# EAGLE schematic led-test (EAGLE 8.3.2)
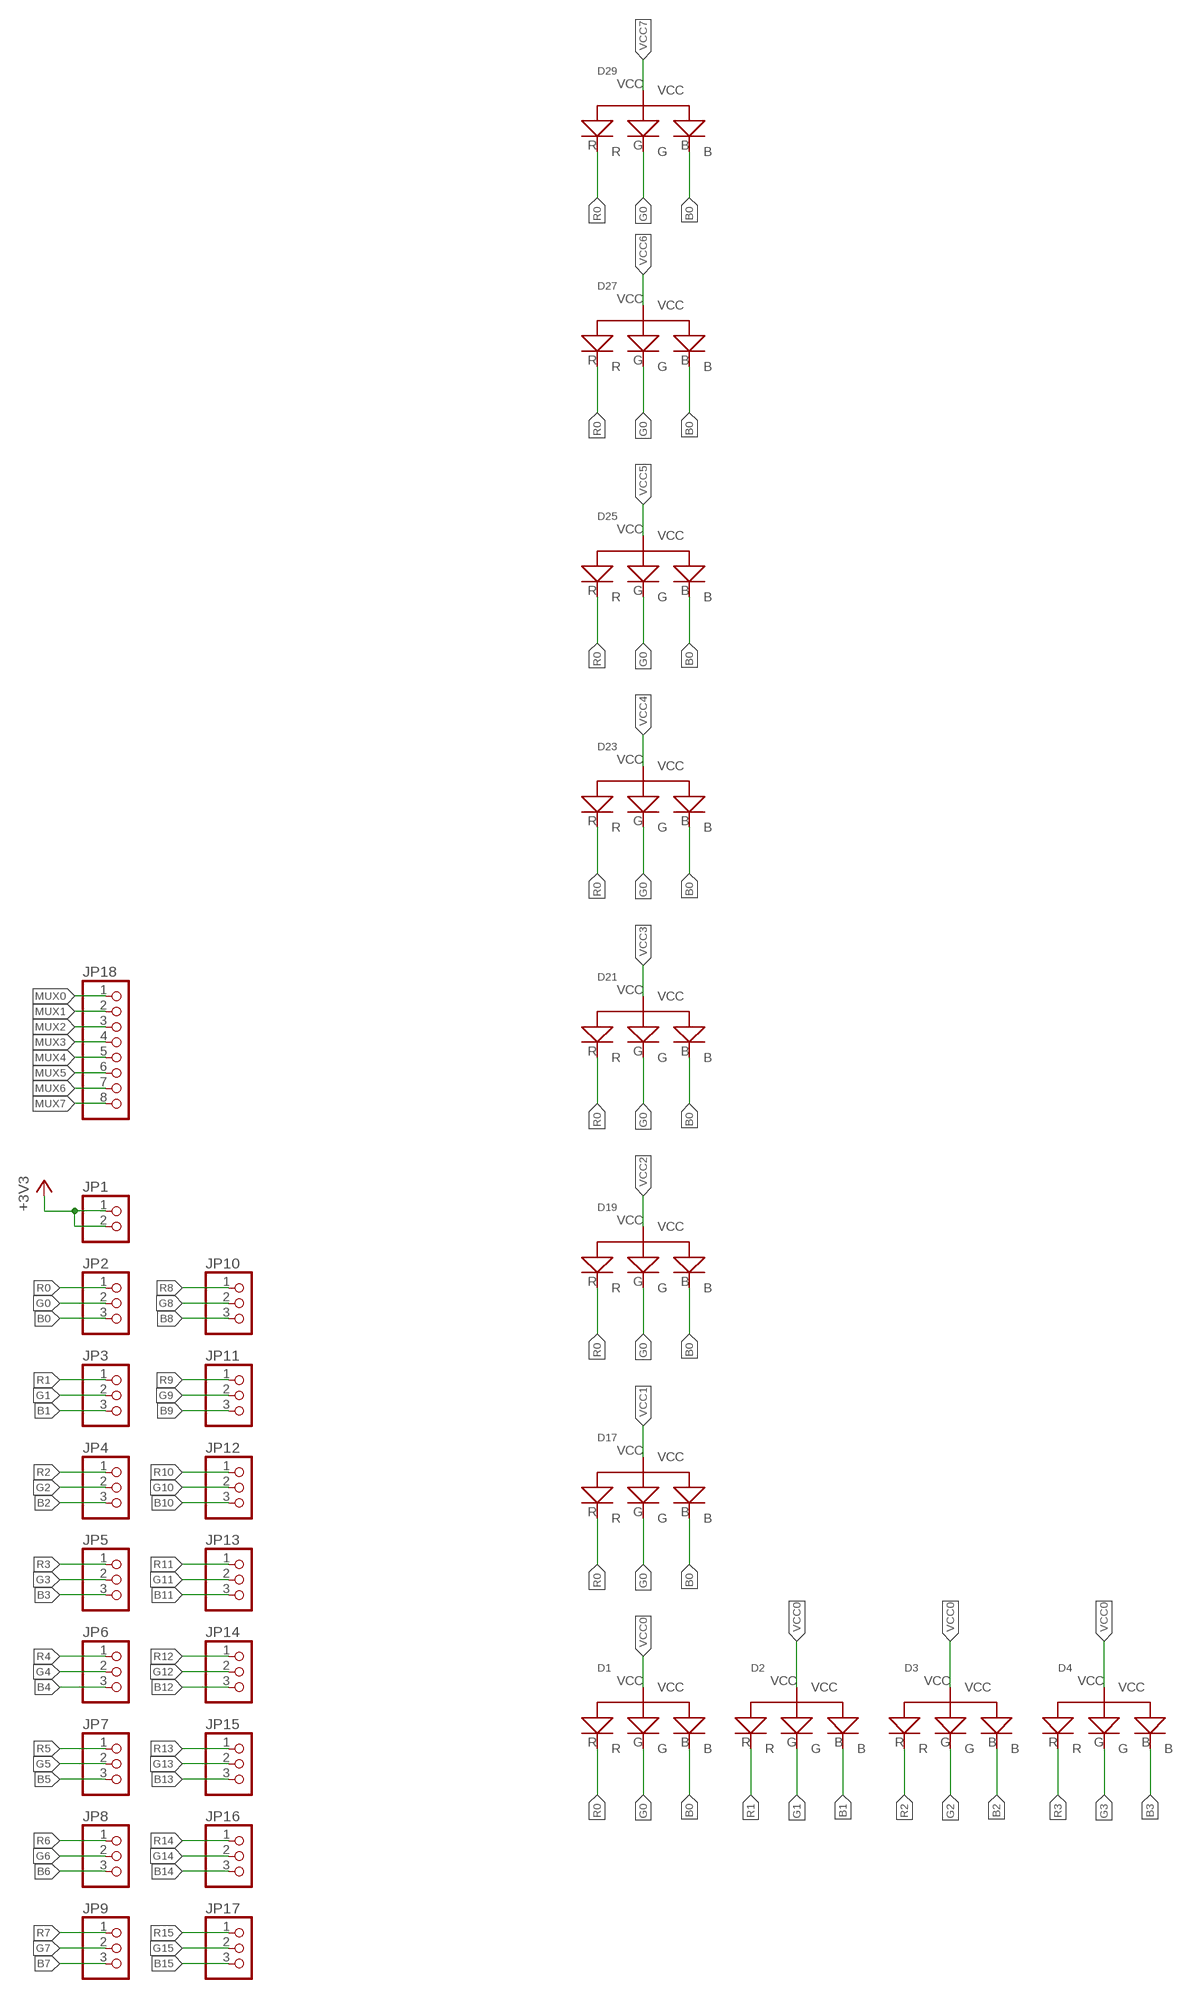
[diagram p0: schematic, sheet 1, part 1 of 2]
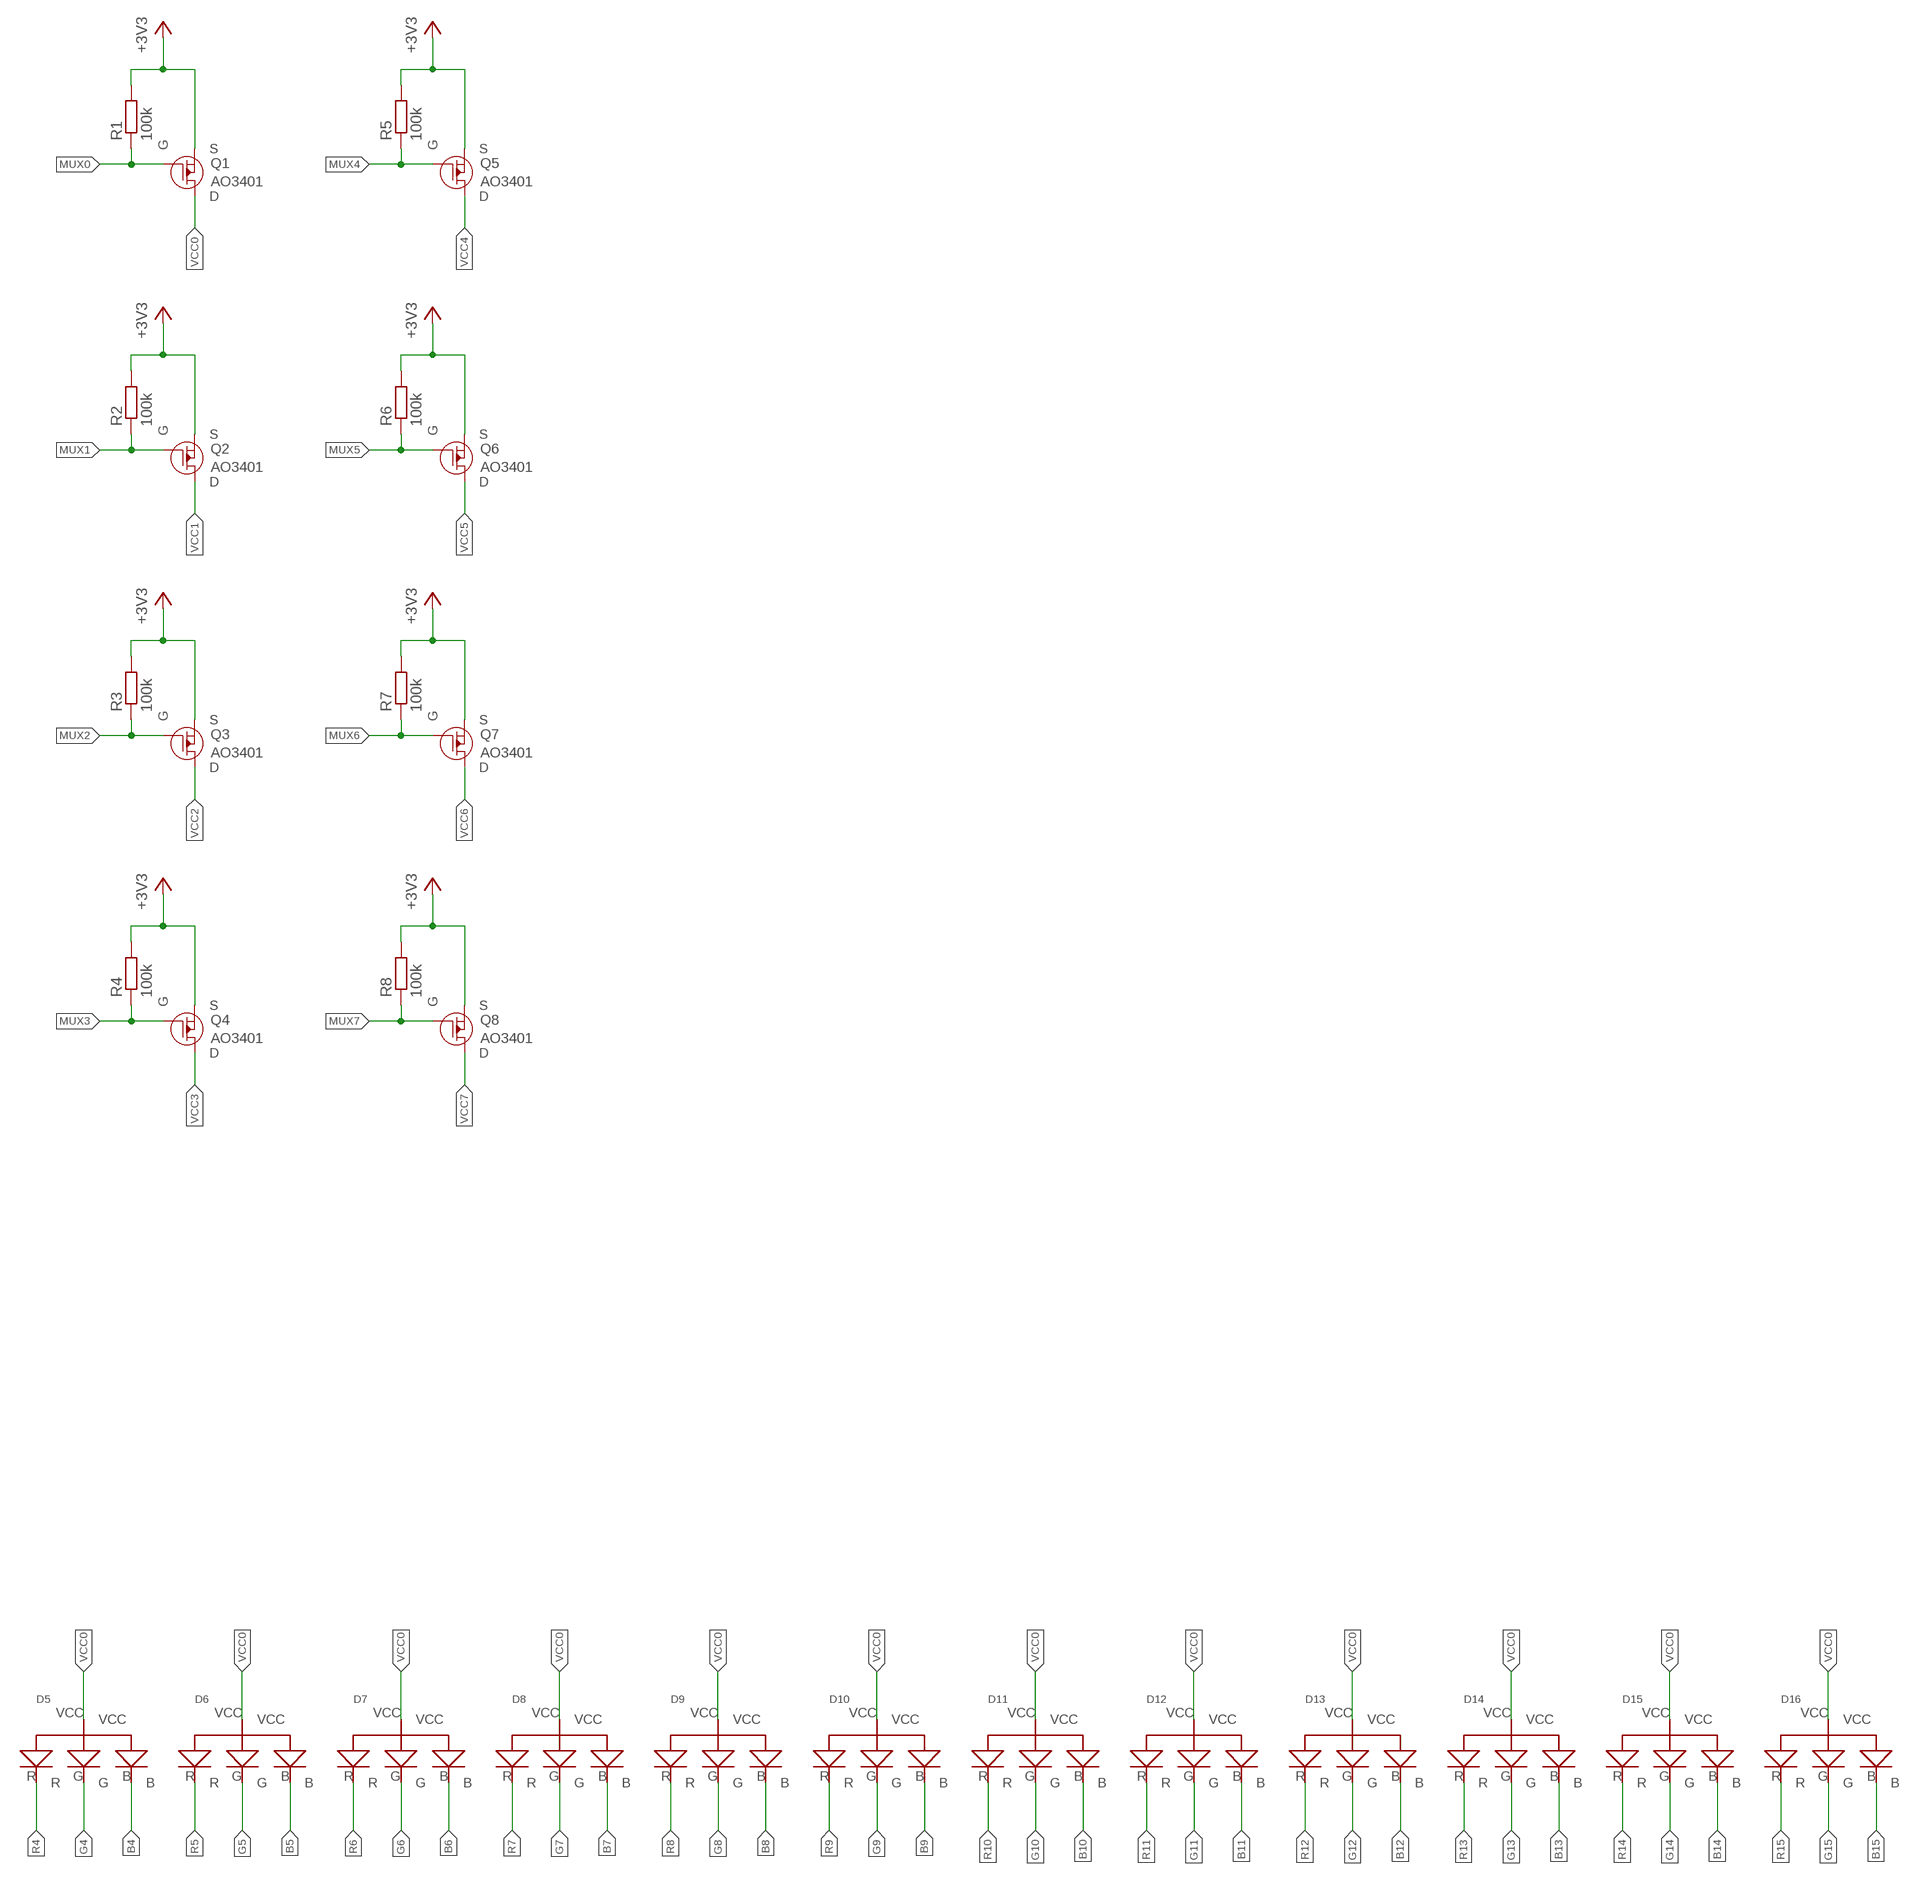
[diagram p1: schematic, sheet 1, part 2 of 2]

## Parts
D1  LED3  [LED3]
D2  LED3  [LED3]
D3  LED3  [LED3]
D4  LED3  [LED3]
D5  LED3  [LED3]
D6  LED3  [LED3]
D7  LED3  [LED3]
D8  LED3  [LED3]
D9  LED3  [LED3]
D10  LED3  [LED3]
D11  LED3  [LED3]
D12  LED3  [LED3]
D13  LED3  [LED3]
D14  LED3  [LED3]
D15  LED3  [LED3]
D16  LED3  [LED3]
D17  LED3  [LED3]
D19  LED3  [LED3]
D21  LED3  [LED3]
D23  LED3  [LED3]
D25  LED3  [LED3]
D27  LED3  [LED3]
D29  LED3  [LED3]
JP1  PINHD-1X2  [1X02]
JP2  PINHD-1X3  [1X03]
JP3  PINHD-1X3  [1X03]
JP4  PINHD-1X3  [1X03]
JP5  PINHD-1X3  [1X03]
JP6  PINHD-1X3  [1X03]
JP7  PINHD-1X3  [1X03]
JP8  PINHD-1X3  [1X03]
JP9  PINHD-1X3  [1X03]
JP10  PINHD-1X3  [1X03]
JP11  PINHD-1X3  [1X03]
JP12  PINHD-1X3  [1X03]
JP13  PINHD-1X3  [1X03]
JP14  PINHD-1X3  [1X03]
JP15  PINHD-1X3  [1X03]
JP16  PINHD-1X3  [1X03]
JP17  PINHD-1X3  [1X03]
JP18  PINHD-1X8  [1X08]
Q1  AO3401  [SOT23-3]
Q2  AO3401  [SOT23-3]
Q3  AO3401  [SOT23-3]
Q4  AO3401  [SOT23-3]
Q5  AO3401  [SOT23-3]
Q6  AO3401  [SOT23-3]
Q7  AO3401  [SOT23-3]
Q8  AO3401  [SOT23-3]
R1  100k  R-EU_M0805  [M0805]
R2  100k  R-EU_M0805  [M0805]
R3  100k  R-EU_M0805  [M0805]
R4  100k  R-EU_M0805  [M0805]
R5  100k  R-EU_M0805  [M0805]
R6  100k  R-EU_M0805  [M0805]
R7  100k  R-EU_M0805  [M0805]
R8  100k  R-EU_M0805  [M0805]

## Nets
+3V3: JP1.1 JP1.2 Q1.2(S) Q2.2(S) Q3.2(S) Q4.2(S) Q5.2(S) Q6.2(S) Q7.2(S) Q8.2(S) R1.2 R2.2 R3.2 R4.2 R5.2 R6.2 R7.2 R8.2
B0: D1.B D17.B D19.B D21.B D23.B D25.B D27.B D29.B JP2.3
B1: D2.B JP3.3
B2: D3.B JP4.3
B3: D4.B JP5.3
B4: D5.B JP6.3
B5: D6.B JP7.3
B6: D7.B JP8.3
B7: D8.B JP9.3
B8: D9.B JP10.3
B9: D10.B JP11.3
B10: D11.B JP12.3
B11: D12.B JP13.3
B12: D13.B JP14.3
B13: D14.B JP15.3
B14: D15.B JP16.3
B15: D16.B JP17.3
G0: D1.G D17.G D19.G D21.G D23.G D25.G D27.G D29.G JP2.2
G1: D2.G JP3.2
G2: D3.G JP4.2
G3: D4.G JP5.2
G4: D5.G JP6.2
G5: D6.G JP7.2
G6: D7.G JP8.2
G7: D8.G JP9.2
G8: D9.G JP10.2
G9: D10.G JP11.2
G10: D11.G JP12.2
G11: D12.G JP13.2
G12: D13.G JP14.2
G13: D14.G JP15.2
G14: D15.G JP16.2
G15: D16.G JP17.2
MUX0: JP18.1 Q1.1(G) R1.1
MUX1: JP18.2 Q2.1(G) R2.1
MUX2: JP18.3 Q3.1(G) R3.1
MUX3: JP18.4 Q4.1(G) R4.1
MUX4: JP18.5 Q5.1(G) R5.1
MUX5: JP18.6 Q6.1(G) R6.1
MUX6: JP18.7 Q7.1(G) R7.1
MUX7: JP18.8 Q8.1(G) R8.1
R0: D1.R D17.R D19.R D21.R D23.R D25.R D27.R D29.R JP2.1
R1: D2.R JP3.1
R2: D3.R JP4.1
R3: D4.R JP5.1
R4: D5.R JP6.1
R5: D6.R JP7.1
R6: D7.R JP8.1
R7: D8.R JP9.1
R8: D9.R JP10.1
R9: D10.R JP11.1
R10: D11.R JP12.1
R11: D12.R JP13.1
R12: D13.R JP14.1
R13: D14.R JP15.1
R14: D15.R JP16.1
R15: D16.R JP17.1
VCC0: D1.VCC D2.VCC D3.VCC D4.VCC D5.VCC D6.VCC D7.VCC D8.VCC D9.VCC D10.VCC D11.VCC D12.VCC D13.VCC D14.VCC D15.VCC D16.VCC Q1.3(D)
VCC1: D17.VCC Q2.3(D)
VCC2: D19.VCC Q3.3(D)
VCC3: D21.VCC Q4.3(D)
VCC4: D23.VCC Q5.3(D)
VCC5: D25.VCC Q6.3(D)
VCC6: D27.VCC Q7.3(D)
VCC7: D29.VCC Q8.3(D)

## Library data of the parts
D1-D17 D19 D21 D23 D25 D27 D29 = rose:LED3
JP1 = pinhead:PINHD-1X2: PIN HEADER
JP2-JP17 = pinhead:PINHD-1X3: PIN HEADER
JP18 = pinhead:PINHD-1X8: PIN HEADER
Q1-Q8 = tuetuopay:AO3401
R1-R8 = rcl:R-EU_: RESISTOR, European symbol